# EAGLE design zxld381-boost-driver-24mm-9leds-mk-1 (EAGLE 6.4)
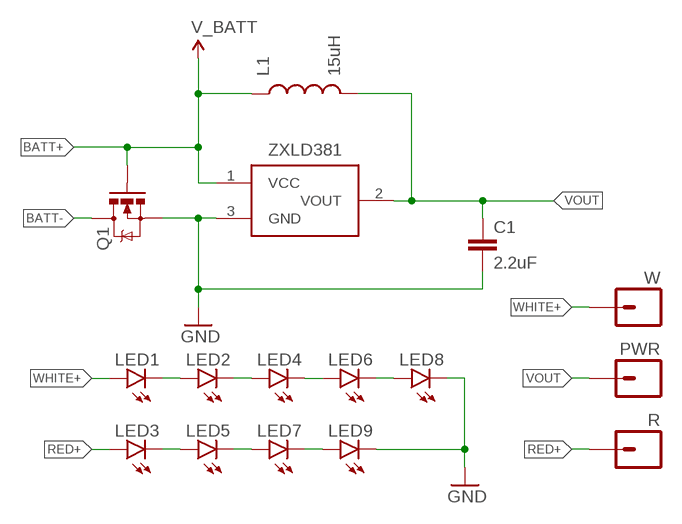
[diagram p0: schematic, sheet 1]

## Parts
C1  2.2uF  CAPACITOR-CERAMICC0805  [C0805]
L1  15uH  INDUCTORL0805  [L0805]
LED1  LED5MM_SHORTPADS  [LED5MM_SHORTPADS]
LED2  LED5MM_SHORTPADS  [LED5MM_SHORTPADS]
LED3  LED5MM_SHORTPADS  [LED5MM_SHORTPADS]
LED4  LED5MM_SHORTPADS  [LED5MM_SHORTPADS]
LED5  LED5MM_SHORTPADS  [LED5MM_SHORTPADS]
LED6  LED5MM_SHORTPADS  [LED5MM_SHORTPADS]
LED7  LED5MM_SHORTPADS  [LED5MM_SHORTPADS]
LED8  LED5MM_SHORTPADS  [LED5MM_SHORTPADS]
LED9  LED5MM_SHORTPADS  [LED5MM_SHORTPADS]
PWR  M01PTH-TINY  [1X01_635UM]
Q1  MOSFET-NCHANNELIRLML2502  [SOT23]
R  M01PTH-TINY  [1X01_635UM]
W  M01PTH-TINY  [1X01_635UM]
ZXLD381  ZXLD381  [SOT23-3]

## Nets
BATT+: L1.1 Q1.1(G) ZXLD381.1(VCC) ; supply symbol labelled V_BATT
BATT-: Q1.3(D)
GND: C1.2 LED8.K(C) LED9.K(C) Q1.2(S) ZXLD381.3(GND)
N$1: LED1.K(C) LED2.A
N$2: LED2.K(C) LED4.A
N$3: LED4.K(C) LED6.A
N$4: LED6.K(C) LED8.A
N$5: LED3.K(C) LED5.A
N$6: LED5.K(C) LED7.A
N$8: LED7.K(C) LED9.A
RED+: LED3.A R.P$1
VOUT: C1.1 L1.2 PWR.P$1 ZXLD381.2(VOUT)
WHITE+: LED1.A W.P$1

## Library data of the parts
C1 = A_butts:CAPACITOR-CERAMIC: CAPACITOR, European symbol
L1 = A_butts:INDUCTOR: Inductors Basic Inductor/Choke - 0603 and 1206. Footprints are not proven and vary greatly between part numbers. SRN6045- 33uH, 20% 1.4A SDR0403-560KL - 56uH, 10%, 500mA RMS/740mA peak
LED1-LED9 = A_butts:LED: LEDs Standard schematic elements and footprints for 5mm, 3mm, 1206, and 0603 sized LEDs. 5mm - Spark Fun Electronics SKU : COM-00529 (and others)
PWR R W = A_butts:M01: Header 1 Standard 1-pin 0.1" header. Use with straight break away headers (SKU : PRT-00116), right angle break away headers (PRT-00553), swiss pins (PRT-00743), machine pins (PRT-00117), and female headers (PRT-00115).
Q1 = A_butts:MOSFET-NCHANNEL: Common NMOSFET Parts MFG P/N Store ID Prod ID FDD8780 TRANS-09984 SI7820DN TRANS-11055 FDS6630A IC-08089 2N7002PW TRANS-11151 FQP30N06L COM-10213 TRANS-10060 BSS123LT1G TRANS-08345 BSS138 TRANS-00830 BS170 2N7000
ZXLD381 = A_butts:ZXLD381

## Board
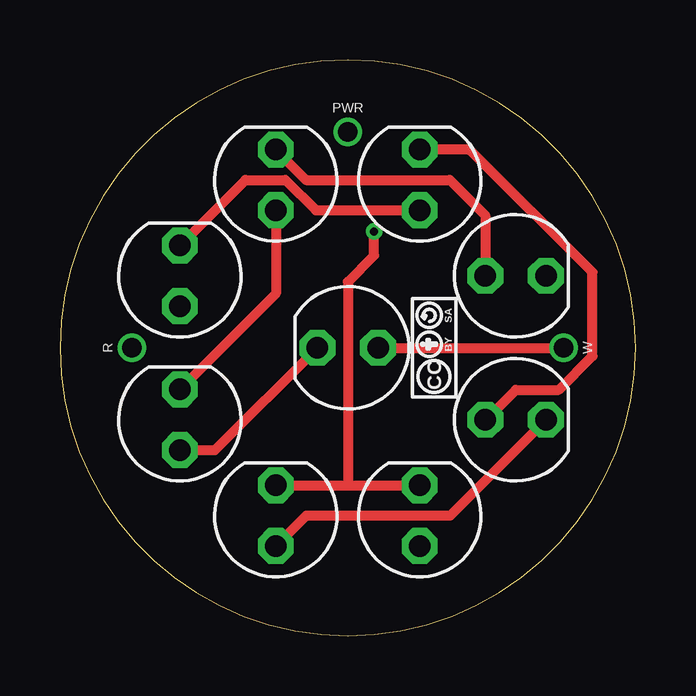
[diagram p1: board, top side]
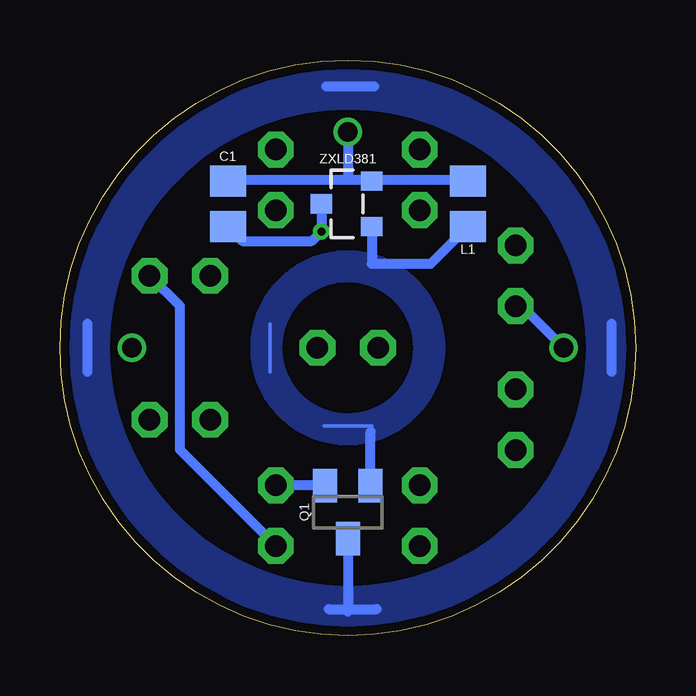
[diagram p2: board, bottom side, seen from below]

Size 24 x 24 mm. Coordinates in mm from the lower left corner, seen from the top.
Outline: 0,12 arc90 12,0 arc90 24,12 arc90 12,24 arc90 0,12
Copper layers (1*16): Top 0.0356mm / dielectric 1.5011mm / Bottom 0.0356mm
Design rules "LaenPCBOrder2": minimum track width 6mil, minimum drill 13mil, track to track 6mil, track to pad 6mil, pad to pad 6mil, via to via 6mil, smd to smd 6mil, copper to edge 15mil, drill to drill 6mil, minimum pad ring 7mil, minimum via ring 7mil, stop-mask expansion 3mil, vias tented up to drill 20mil, thermal gap 10mil

### Footprints (pad centres in the part's own frame; a part is rotated, then mirrored left to right if it is on the bottom)
C0805 = smd 1.3 x 1.5: 1 -0.95,0; 2 0.95,0
L0805 = smd 1.3 x 1.5: 1 -0.95,0; 2 0.95,0
LED5MM_SHORTPADS = drill 0.9 pad 1.499 octagon: A -1.27,0; K 1.27,0
1X01_635UM = drill 0.8: P$1 0,0
SOT23 = smd 1 x 1.4: 1 -0.95,-1.1; 2 0.95,-1.1; 3 0,1.1
SOT23-3 = smd 0.8 x 0.9: 1 -0.95,-1; 2 0.95,-1; 3 0,1.1

### Placement (x,y rotation side)
C1  17,18 270 bottom
L1  7,18 90 bottom
LED1  12,12 180 top
LED2  5,9 90 top
LED3  5,15 90 top
LED4  9,19 90 top
LED5  15,19 90 top
LED6  19,15 0 top
LED7  19,9 0 top
LED8  15,5 90 top
LED9  9,5 90 top
PWR  12,21 0 top
Q1  12,5.15 180 bottom
R  3,12 90 top
U$1  [CC-BY-SA-4.0-SMALL]  15.6,12 90 top
W  21,12 270 top
ZXLD381  12,18 90 bottom

### Tracks (layer width: path | path; a pad name or v marks a point on that pad's centre or on a via)
BATT+
  Bottom 0.152: 11,8.75 13,8.75 | 15.25,11 15.25,13
  Bottom 0.406: ZXLD381.1 11,15.5 8.55,15.5 L1.1 | Q1.1 11.05,8.5
  pour Bottom: 8,12 arc-90 12,16 12,14.8 arc90 9.2,12
  pour Bottom: 12,8 arc-90 8,12 9.2,12 arc90 12,9.2
  pour Bottom: 12,16 arc-90 16,12 14.8,12 arc90 12,14.8
  pour Bottom: 16,12 arc-90 12,8 12,9.2 arc90 14.8,12
BATT-
  Bottom 0.406: 1,11 1,13 | 12.9,22.9 10.9,22.9 | 12.8,1.1 10.8,1.1 | Q1.3 12,1 | 22.84,11 22.84,13
  pour Bottom: 0,12 arc-90 12,24 12,22 arc90 2,12
  pour Bottom: 12,0 arc-90 0,12 2,12 arc90 12,2
  pour Bottom: 24,12 arc-90 12,0 12,2 arc90 22,12
  pour Bottom: 12,24 arc-90 24,12 22,12 arc90 12,22
GND  (via drill 0.33)
  Top 0.406: LED9.K 12,6.27 | 12,6.27 LED8.K | 12,6.27 12,14.75 13.1,15.85 v13.1,16.85
  Bottom 0.406: Q1.2 12.97,6.27 LED8.K | ZXLD381.3 v13.1,16.85 13.5,16.45 16.4,16.45 C1.2
N$1
  Top 0.406: LED2.A 6.46,7.73 LED1.K
N$2
  Top 0.406: LED4.A 9,14.27 LED2.K
N$3
  Top 0.406: LED4.K 9,20.25 10.25,19 16.25,19 17.73,17.52 LED6.A
N$4
  Bottom 0.406: LED8.A 15,3.75 19,7.75 19,13.73 LED6.K
N$5
  Top 0.406: LED3.K 7.73,19 9.4,19 10.67,17.73 LED5.A
N$6
  Top 0.406: LED7.A 17.75,9 19,10.25 20.8,10.25 22.2,11.65 22.2,15.15 17.08,20.27 LED5.K
N$8
  Top 0.406: LED7.K 16.27,5 10.27,5 LED9.A
RED+
  Bottom 0.406: R.P$1 4.73,13.73 LED3.A
VOUT
  Bottom 0.406: 10.95,19 ZXLD381.2 11.05,19 | L1.2 7.1,19 11.05,19 | 11.05,19 12.15,19 | 12.15,19 16.95,19 C1.1 | PWR.P$1 12,19.15 12.15,19
WHITE+
  Top 0.406: LED1.A W.P$1